# Altium project 磁导航.PrjPCB
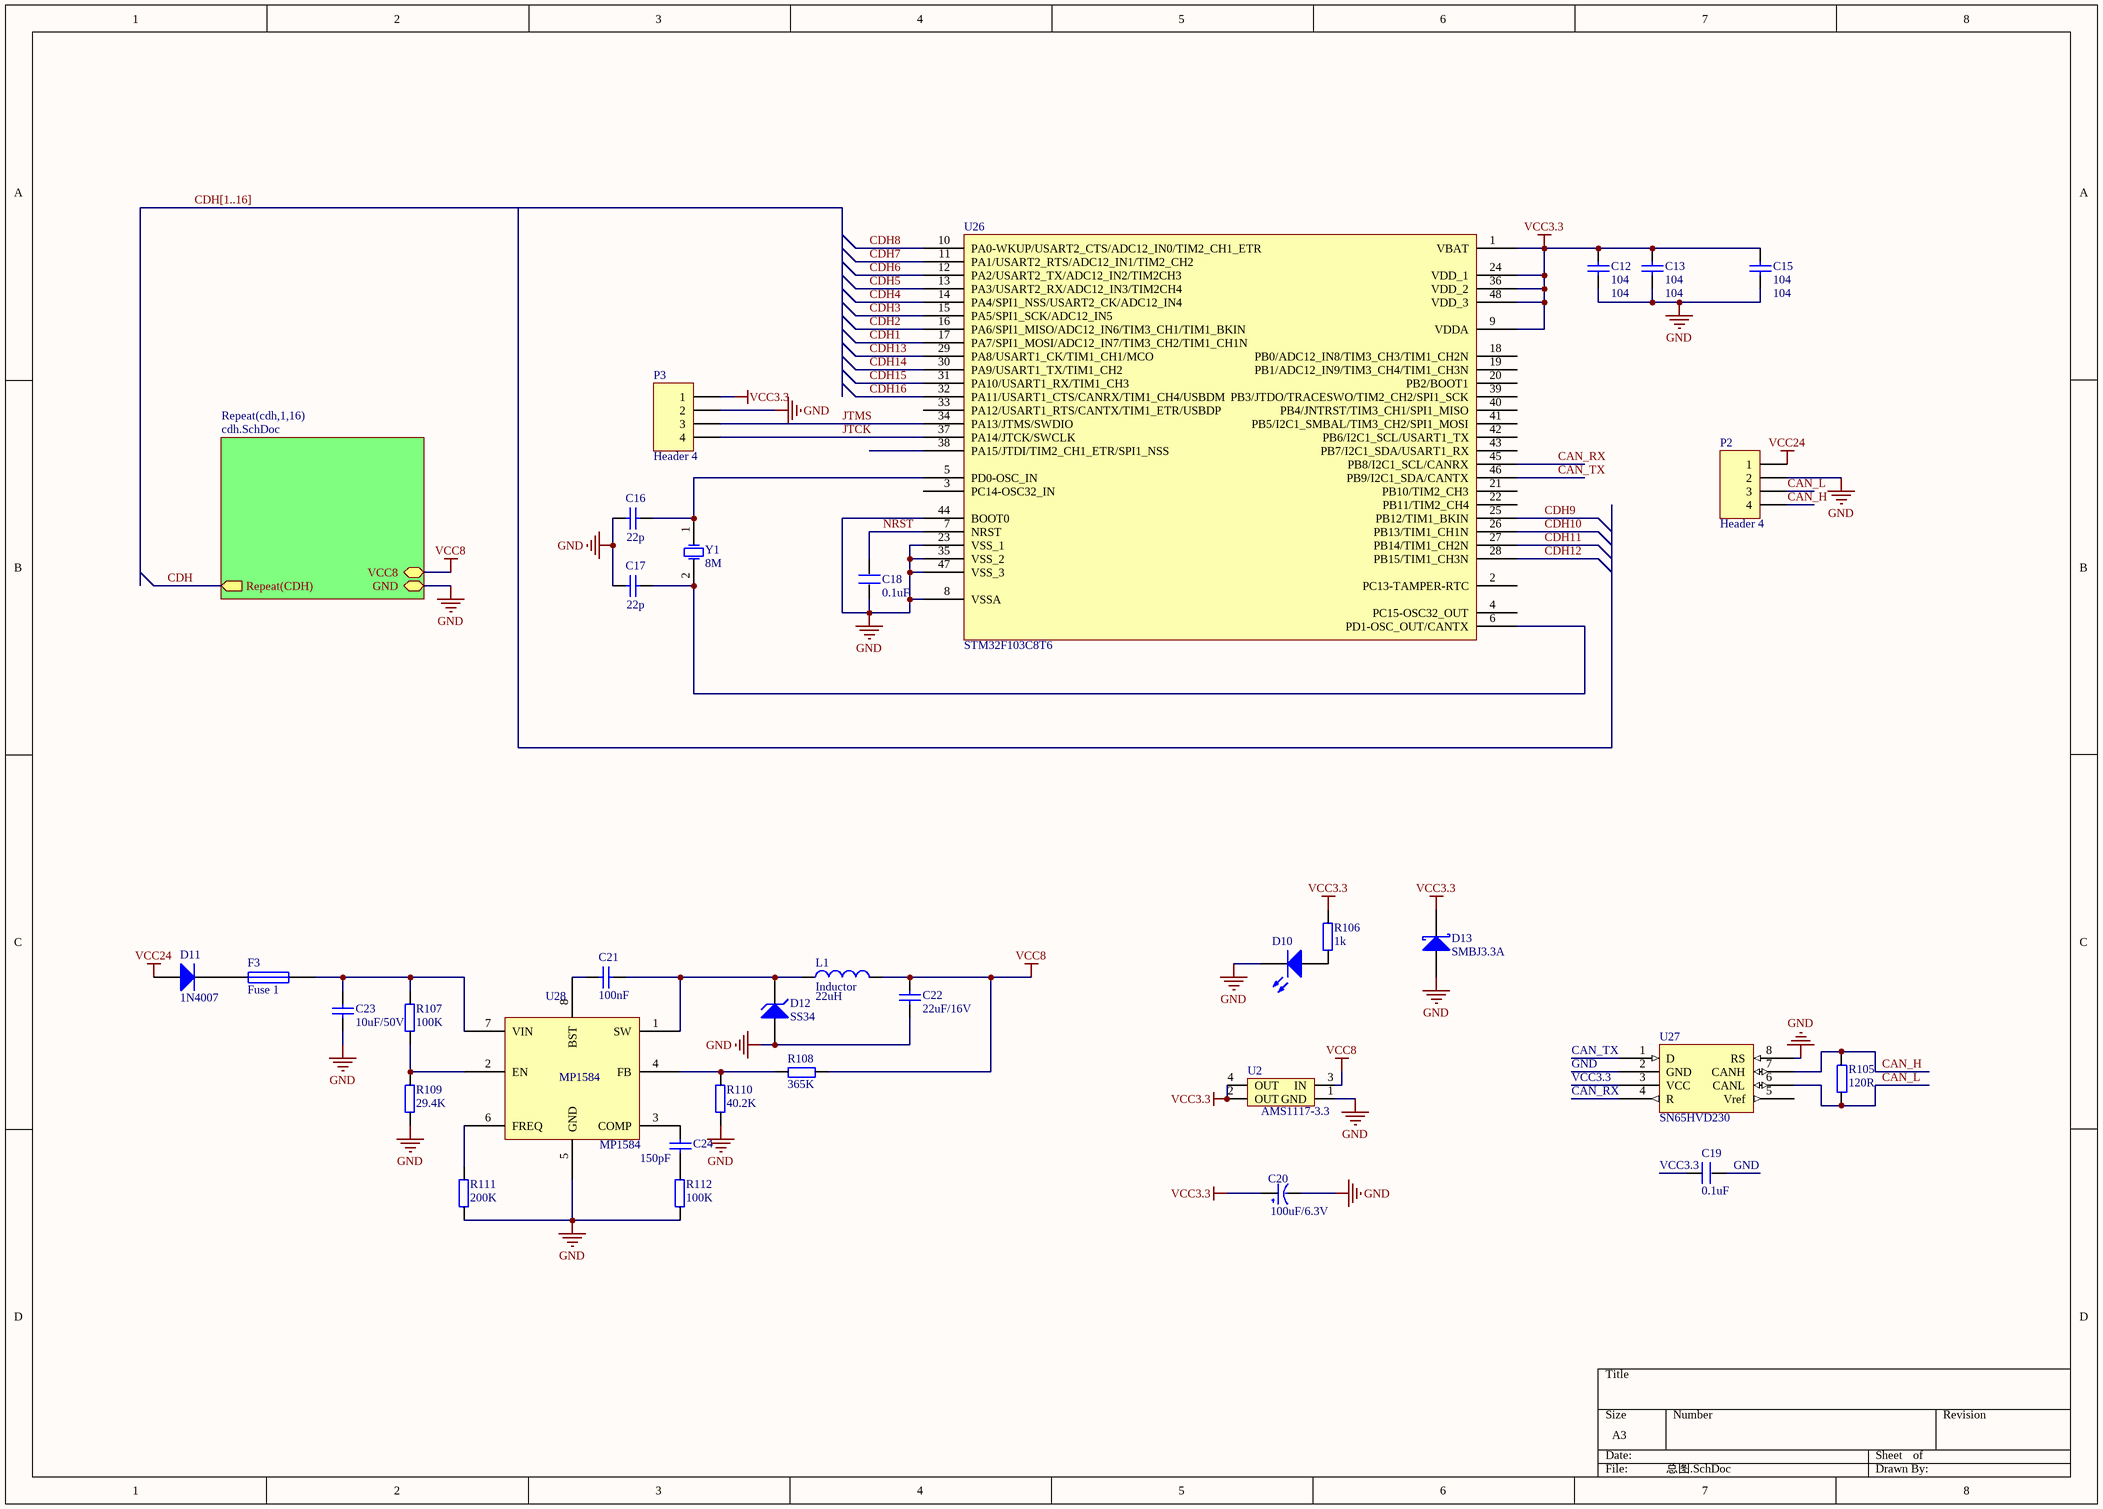
[diagram p0: 总图.SchDoc]
2 sheets, 337 parts. Net scope: hierarchical (ports join the sheet entries above them; power ports are global).
Board files: 磁导航.PcbDoc, 多通道.PcbDoc, 多通道.~(1096).PcbDoc, 尺寸.PcbDoc
Sheets:
  总图.SchDoc
    cdh1 = cdh.SchDoc
    cdh2 = cdh.SchDoc
    cdh3 = cdh.SchDoc
    cdh4 = cdh.SchDoc
    cdh5 = cdh.SchDoc
    cdh6 = cdh.SchDoc
    cdh7 = cdh.SchDoc
    cdh8 = cdh.SchDoc
    cdh9 = cdh.SchDoc
    cdh10 = cdh.SchDoc
    cdh11 = cdh.SchDoc
    cdh12 = cdh.SchDoc
    cdh13 = cdh.SchDoc
    cdh14 = cdh.SchDoc
    cdh15 = cdh.SchDoc
    cdh16 = cdh.SchDoc

## Sheet 总图.SchDoc
size A3

### Parts
C12  104  [0603-CAP]
C13  104  [0603-CAP]
C15  104  [0603-CAP]
C16  22p  [0603-CAP]
C17  22p  [0603-CAP]
C18  0.1uF  [0603-CAP]
C19  0.1uF  [0603-CAP]
C20  100uF/6.3V  [3216]
C21  value 100nF  [0603-CAP]  (hidden comment: 0.1uF)
C22  22uF/16V  [1206]
C23  10uF/50V  [1206]
C24  value 150pF  [0603-CAP]  (hidden comment: 0.1uF)
D10  LED0  [LC-0805_LED_S1]  (value not drawn)
D11  1N4007  [SMA(DO-214AC)_S1]
D12  SS34  [SMA(DO-214AC)_S1]
D13  SMBJ3.3A  [SMB(DO-214AA)_S1]
F3  Fuse 1  [1206]
L1  Inductor  value 22uH  [L-7*7*4mm-S]
P2  Header 4  [DZ-4-3.5]
P3  Header 4  [HDR1X4]
R105  120R  [0603]
R106  1k  [0603]
R107  100K  [0603]
R108  365K  [0603]
R109  29.4K  [0603]
R110  40.2K  [0603]
R111  200K  [0603]
R112  100K  [0603]
U2  AMS1117-3.3  [LC-SOT-223]
U26  STM32F103C8T6  [LC-LQFP-48]
U27  SN65HVD230  [SOP-8]
U28  MP1584  [SO-8]
Y1  8M  [XTAL_US1]

### Sub-sheets
Repeat(cdh,1,16) = cdh.SchDoc: GND (bidir), VCC8 (bidir), Repeat(CDH) (out)

### Nets
GND: C12.2 C13.2 C15.2 C16.2 C17.2 C18.1 C19.2 C20.2(GND) C22.1 C23.2 D10.K D12.1(A) D13.2(A) P2.2 P3.2 R109.2 R110.2 R111.2 R112.2 U2.1(GND) U26.8(VSSA) U26.23(VSS_1) U26.35(VSS_2) U26.44(BOOT0) U26.47(VSS_3) U27.2(GND) U27.8(RS) U28.5(GND) ; sheet Repeat(cdh,1,16)/GND
VCC3.3: C12.1 C13.1 C15.1 C19.1 C20.1(VCC) D13.1(K) P3.1 R106.1 U2.2(OUT) U2.4(OUT) U26.1(VBAT) U26.9(VDDA) U26.24(VDD_1) U26.36(VDD_2) U26.48(VDD_3) U27.3(VCC)
VCC8: C22.2 L1.2 R108.2 U2.3(IN) ; sheet Repeat(cdh,1,16)/VCC8
VCC24: D11.1(A) P2.1
CAN_H: P2.4 R105.2 U27.7(CANH)
CAN_L: P2.3 R105.1 U27.6(CANL)
CAN_RX: U26.45(PB8/I2C1_SCL/CANRX) U27.4(R)
CAN_TX: U26.46(PB9/I2C1_SDA/CANTX) U27.1(D)
CDH: sheet Repeat(cdh,1,16)/Repeat(CDH)
CDH1: U26.17(PA7/SPI1_MOSI/ADC12_IN7/TIM3_CH2/TIM1_CH1N)
CDH2: U26.16(PA6/SPI1_MISO/ADC12_IN6/TIM3_CH1/TIM1_BKIN)
CDH3: U26.15(PA5/SPI1_SCK/ADC12_IN5)
CDH4: U26.14(PA4/SPI1_NSS/USART2_CK/ADC12_IN4)
CDH5: U26.13(PA3/USART2_RX/ADC12_IN3/TIM2CH4)
CDH6: U26.12(PA2/USART2_TX/ADC12_IN2/TIM2CH3)
CDH7: U26.11(PA1/USART2_RTS/ADC12_IN1/TIM2_CH2)
CDH8: U26.10(PA0-WKUP/USART2_CTS/ADC12_IN0/TIM2_CH1_ETR)
CDH9: U26.25(PB12/TIM1_BKIN)
CDH10: U26.26(PB13/TIM1_CH1N)
CDH11: U26.27(PB14/TIM1_CH2N)
CDH12: U26.28(PB15/TIM1_CH3N)
CDH13: U26.29(PA8/USART1_CK/TIM1_CH1/MCO)
CDH14: U26.30(PA9/USART1_TX/TIM1_CH2)
CDH15: U26.31(PA10/USART1_RX/TIM1_CH3)
CDH16: U26.32(PA11/USART1_CTS/CANRX/TIM1_CH4/USBDM)
JTCK: P3.4 U26.37(PA14/JTCK/SWCLK)
JTMS: P3.3 U26.34(PA13/JTMS/SWDIO)
NRST: C18.2 U26.7(NRST)
NetC16_1: C16.1 U26.5(PD0-OSC_IN) Y1.1(OSC1)
NetC17_1: C17.1 U26.6(PD1-OSC_OUT/CANTX) Y1.2(OSC2)
NetC21_1: C21.1 D12.2(K) L1.1 U28.1(SW)
NetC21_2: C21.2 U28.8(BST)
NetC23_1: C23.1 F3.2 R107.1 U28.7(VIN)
NetC24_1: C24.1 R112.1
NetC24_2: C24.2 U28.3(COMP)
NetD10_A: D10.A R106.2
NetD11_2: D11.2(K) F3.1
NetR107_2: R107.2 R109.1 U28.2(EN)
NetR108_1: R108.1 R110.1 U28.4(FB)
NetR111_1: R111.1 U28.6(FREQ)

Not connected (* = marked no-connect by the designer): U26 2(PC13-TAMPER-RTC) 3(PC14-OSC32_IN) 4(PC15-OSC32_OUT) 18(PB0/ADC12_IN8/TIM3_CH3/TIM1_CH2N) 19(PB1/ADC12_IN9/TIM3_CH4/TIM1_CH3N) 20(PB2/BOOT1) 21(PB10/TIM2_CH3) 22(PB11/TIM2_CH4) 33(PA12/USART1_RTS/CANTX/TIM1_ETR/USBDP) 38(PA15/JTDI/TIM2_CH1_ETR/SPI1_NSS) 39(PB3/JTDO/TRACESWO/TIM2_CH2/SPI1_SCK) 40(PB4/JNTRST/TIM3_CH1/SPI1_MISO) 41(PB5/I2C1_SMBAL/TIM3_CH2/SPI1_MOSI) 42(PB6/I2C1_SCL/USART1_TX) 43(PB7/I2C1_SDA/USART1_RX); U27 5(Vref)

### Buses and harness runs
bus CDH[1..16]

### Library data of the parts
C12 C13 C15-C17 = Cap: Capacitor; Published: 8-Jun-2000; LatestRevisionDate: 17-Jul-2002; LatestRevisionNote: Re-released for DXP Platform.; PackageReference: RAD-0.3; Publisher: Altium Limited; PackageDescription: Radial Cap, Thru-Hole; 2 Leads; 0.3 in Pin Spacing
  C12 C13 C15: Value: 104
  C16 C17: Value: 22p
C18 = C
C19 = C_3
C20 = CAP
C21-C24 = Cap Semi: Capacitor (Semiconductor SIM Model); Published: 8-Jun-2000; LatestRevisionDate: 29-May-2009; LatestRevisionNote: IPC-7351 Footprint Added.; PackageReference: C1206; Publisher: Altium Limited; PackageDescription: Chip Capacitor
  C22: Value: 22uF/16V
  C23: Value: 10uF/50V
D10 = LED0: Typical INFRARED GaAs LED; Published: 8-Jun-2000; LatestRevisionDate: 08-Jul-2005; LatestRevisionNote: Mech Layer 1 removed.; PackageReference: LED-0; Publisher: Altium Limited; PackageDescription: LED; 2 Leads
D11 = Diode: Default Diode; Published: 8-Jun-2000; LatestRevisionDate: 17-Jul-2002; LatestRevisionNote: Re-released for DXP Platform.; PackageVersion: Sep-1996; PackageReference: SMC; Publisher: Altium Limited; PackageDescription: DO-214-AB/SMC; 2 C-Bend Leads; Body 7.9 x 5.9 mm, inc. leads (LxW); Code_JEDEC: DO-214-AB
D12 = D Zener: Zener Diode; Published: 8-Jun-2000; LatestRevisionDate: 17-Jul-2002; LatestRevisionNote: Re-released for DXP Platform.; PackageReference: DIODE-0.7; Publisher: Altium Limited; PackageDescription: Diode, Thru-Hole; 2 Leads; 0.7 in Pin Spacing
D13 = Diode 18TQ045: Schottky Rectifier; Note: Terminal 2 is the TAB and is electrically connected to the cathode; Published: 8-Jun-2000; LatestRevisionDate: 17-Jul-2002; LatestRevisionNote: Re-released for DXP Platform.; DatasheetVersion: Dec-1997; PackageVersion: Feb-1998; PackageReference: TO-220AC; Publisher: Altium Limited; PackageDescription: TO, Thru-Hole, Vertical, Heatsink Mounted; 3 In-Line Leads (1 Absent); Pitch 2.54 mm; ComponentLink1Description: Manufacturer Link; ComponentLink1URL: http://www.irf.com/; ComponentLink2Description: Datasheet; ComponentLink2URL: http://www.irf.com/product-info/datasheets/data/18tq.pdf
F3 = Fuse 1: Fuse; Published: 8-Jun-2000; LatestRevisionDate: 17-Jul-2002; LatestRevisionNote: Re-released for DXP Platform.; PackageReference: PIN-W2/E2.8; Publisher: Altium Limited; PackageDescription: Thru-Hole; 2 Leads
L1 = Inductor: Code_IEC: 1005; Published: 8-Jun-2000; LatestRevisionDate: 29-May-2009; LatestRevisionNote: IPC-7351 Footprint Added.; PackageReference: 0402-A; Publisher: Altium Limited; PackageDescription: Chip Inductor; Code_JEITA: 0402
P2 P3 = Header 4: Header, 4-Pin; LatestRevisionDate: 17-Jul-2002; LatestRevisionNote: Re-released for DXP Platform.; Publisher: Altium Limited
R105-R112 = R_2
U2 = AMS1117
U26 = stm32f103v8t6
U27 = SN65HVD230D
U28 = MP1584EN
Y1 = XTAL: Crystal Oscillator; Published: 8-Jun-2000; LatestRevisionDate: 17-Jul-2002; LatestRevisionNote: Re-released for DXP Platform.; PackageReference: R38; Publisher: Altium Limited; PackageDescription: Crystal, Thru-Hole; 2 Leads; Body 3.1 x 8.2 mm (Dia.xH)

## Sheet cdh.SchDoc
size A3
Used 16 times, as channels cdh1, cdh2, cdh3, cdh4, cdh5, cdh6, cdh7, cdh8, cdh9, cdh10, cdh11, cdh12, cdh13, cdh14, cdh15, cdh16. Parts and nets are listed once, with the designators drawn on the sheet.
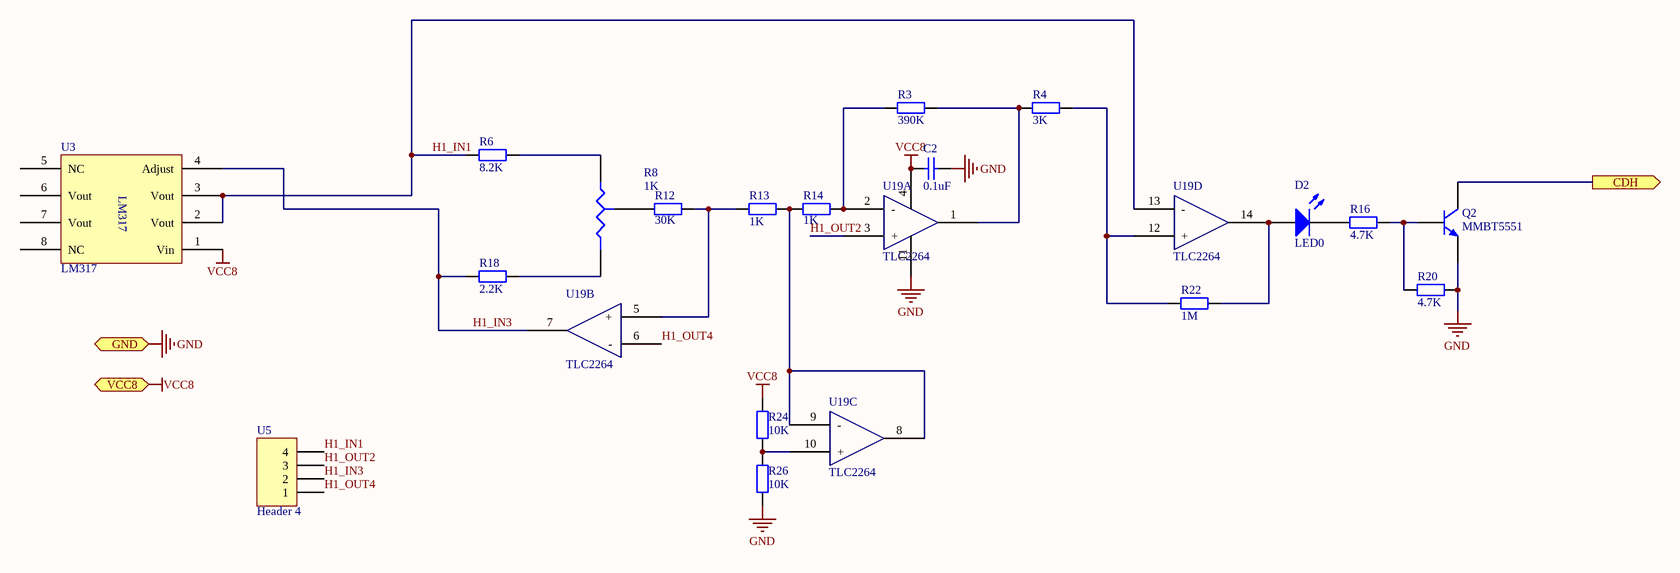
[diagram p1: cdh.SchDoc]

### Parts
C2  0.1uF  [C0805]
D2  LED0  [LED1]
Q2  MMBT5551  [SOT-23]
R3  390K  [0805]
R4  3K  [0805]
R6  8.2K  [0805]
R8  value 1K  [3224W]  (hidden comment: Res Tap)
R12  30K  [0805]
R13  1K  [0805]
R14  1K  [0805]
R16  4.7K  [0603]
R18  2.2K  [0805]
R20  4.7K  [0603]
R22  1M  [0805]
R24  10K  [0805]
R26  10K  [0805]
U3  LM317  [SO-8]
U5  Header 4  [PIN4]
U19  TLC2264  [TSSOP14]  (parts A,B,C,D of 4)

### Ports
CDH (out), GND (bidir), VCC8 (bidir)

### Nets
GND: C2.1 Q2.3(E) R20.2 R26.1 U19.11(GND) ; port GND
VCC8: C2.2 R24.2 U3.1(Vin) U19.4(VCC) ; port VCC8
CDH: Q2.1(C) ; port CDH
H1_IN1: R6.1 U3.2(Vout) U3.3(Vout) U5.4 U19.13(-)
H1_IN3: R18.1 U3.4(Adjust) U5.2 U19.7(2OUT)
H1_OUT2: U5.3 U19.3(+)
H1_OUT4: U5.1 U19.6(-)
NetD2_1: D2.1(A) R22.2 U19.14(4OUT)
NetD2_2: D2.2(K) R16.1
NetQ2_2: Q2.2(B) R16.2 R20.1
NetR3_1: R3.1 R14.1 U19.2(-)
NetR3_2: R3.2 R4.1 U19.1(1OUT)
NetR4_2: R4.2 R22.1 U19.12(+)
NetR6_2: R6.2 R8.1(A)
NetR8_2: R8.2(B) R18.2
NetR8_3: R8.3(TAP) R12.1
NetR12_2: R12.2 R13.1 U19.5(+)
NetR13_2: R13.2 R14.2 U19.8(3OUT) U19.9(-)
NetR24_1: R24.1 R26.2 U19.10(+)

Not connected (* = marked no-connect by the designer): U3 5(NC) 6(Vout) 7(Vout) 8(NC)

### Channels
cdh1: designators end in _cdh1; ports CDH=CDH1 GND=GND VCC8=VCC8
cdh2: designators end in _cdh2; ports CDH=CDH2 GND=GND VCC8=VCC8
cdh3: designators end in _cdh3; ports CDH=CDH3 GND=GND VCC8=VCC8
cdh4: designators end in _cdh4; ports CDH=CDH4 GND=GND VCC8=VCC8
cdh5: designators end in _cdh5; ports CDH=CDH5 GND=GND VCC8=VCC8
cdh6: designators end in _cdh6; ports CDH=CDH6 GND=GND VCC8=VCC8
cdh7: designators end in _cdh7; ports CDH=CDH7 GND=GND VCC8=VCC8
cdh8: designators end in _cdh8; ports CDH=CDH8 GND=GND VCC8=VCC8
cdh9: designators end in _cdh9; ports CDH=CDH9 GND=GND VCC8=VCC8
cdh10: designators end in _cdh10; ports CDH=CDH10 GND=GND VCC8=VCC8
cdh11: designators end in _cdh11; ports CDH=CDH11 GND=GND VCC8=VCC8
cdh12: designators end in _cdh12; ports CDH=CDH12 GND=GND VCC8=VCC8
cdh13: designators end in _cdh13; ports CDH=CDH13 GND=GND VCC8=VCC8
cdh14: designators end in _cdh14; ports CDH=CDH14 GND=GND VCC8=VCC8
cdh15: designators end in _cdh15; ports CDH=CDH15 GND=GND VCC8=VCC8
cdh16: designators end in _cdh16; ports CDH=CDH16 GND=GND VCC8=VCC8

### Library data of the parts
C2 = Cap Semi: Capacitor (Semiconductor SIM Model); Published: 8-Jun-2000; LatestRevisionDate: 29-May-2009; LatestRevisionNote: IPC-7351 Footprint Added.; PackageReference: C1206; Publisher: Altium Limited; PackageDescription: Chip Capacitor; Value: 0.1uF
D2 = LED0: Typical INFRARED GaAs LED; Published: 8-Jun-2000; LatestRevisionDate: 08-Jul-2005; LatestRevisionNote: Mech Layer 1 removed.; PackageReference: LED-0; Publisher: Altium Limited; PackageDescription: LED; 2 Leads
Q2 = NPN: NPN Bipolar Transistor; Published: 8-Jun-2000; LatestRevisionDate: 17-Jul-2002; LatestRevisionNote: Re-released for DXP Platform.; PackageReference: TO-226-AA; Publisher: Altium Limited; PackageDescription: TO, Flat Index; 3 In-Line, Axial Leads; Body Dia. 4.8mm; Leads 0.55 x 0.51 mm (max); Code_JEDEC: TO-226-AA
R3 R4 R6 R12-R14 R16 R18 R20 R22 R24 R26 = Res2: Resistor; Published: 8-Jun-2000; LatestRevisionDate: 17-Jul-2002; LatestRevisionNote: Re-released for DXP Platform.; PackageReference: AXIAL-0.4; Publisher: Altium Limited; PackageDescription: Axial Device, Thru-Hole; 2 Leads; 0.4 in Pin Spacing
  R3: Value: 390K
  R4: Value: 3K
  R6: Value: 8.2K
  R12: Value: 30K
  R13 R14: Value: 1K
  R16 R20: Value: 4.7K
  R18: Value: 2.2K
  R22: Value: 1M
  R24 R26: Value: 10K
R8 = Res Tap: Tapped Resistor; Sim Note: Enter the Resistance value and the set point into parameter fields.; Set Position: 0.5; Published: 24-Mar-1999; LatestRevisionDate: 17-Jul-2002; LatestRevisionNote: Re-released for DXP Platform.; PackageReference: VR3; Publisher: Altium Limited; PackageDescription: Variable Resistor, Thru-Hole; 3 Leads
U5 = Header 4: Header, 4-Pin; LatestRevisionDate: 17-Jul-2002; LatestRevisionNote: Re-released for DXP Platform.; Publisher: Altium Limited

## Nets that join several sheets
GND: 总图 (28 pins), cdh1 (5 pins), cdh2 (5 pins), cdh3 (5 pins), cdh4 (5 pins), cdh5 (5 pins), cdh6 (5 pins), cdh7 (5 pins), cdh8 (5 pins), cdh9 (5 pins), cdh10 (5 pins), cdh11 (5 pins), cdh12 (5 pins), cdh13 (5 pins), cdh14 (5 pins), cdh15 (5 pins), cdh16 (5 pins)
VCC8: 总图 (C22.2 L1.2 R108.2 U2.3), cdh1 (C2_cdh1.2 R24_cdh1.2 U3_cdh1.1 U19_cdh1.4), cdh2 (C2_cdh2.2 R24_cdh2.2 U3_cdh2.1 U19_cdh2.4), cdh3 (C2_cdh3.2 R24_cdh3.2 U3_cdh3.1 U19_cdh3.4), cdh4 (C2_cdh4.2 R24_cdh4.2 U3_cdh4.1 U19_cdh4.4), cdh5 (C2_cdh5.2 R24_cdh5.2 U3_cdh5.1 U19_cdh5.4), cdh6 (C2_cdh6.2 R24_cdh6.2 U3_cdh6.1 U19_cdh6.4), cdh7 (C2_cdh7.2 R24_cdh7.2 U3_cdh7.1 U19_cdh7.4), cdh8 (C2_cdh8.2 R24_cdh8.2 U3_cdh8.1 U19_cdh8.4), cdh9 (C2_cdh9.2 R24_cdh9.2 U3_cdh9.1 U19_cdh9.4), cdh10 (C2_cdh10.2 R24_cdh10.2 U3_cdh10.1 U19_cdh10.4), cdh11 (C2_cdh11.2 R24_cdh11.2 U3_cdh11.1 U19_cdh11.4), cdh12 (C2_cdh12.2 R24_cdh12.2 U3_cdh12.1 U19_cdh12.4), cdh13 (C2_cdh13.2 R24_cdh13.2 U3_cdh13.1 U19_cdh13.4), cdh14 (C2_cdh14.2 R24_cdh14.2 U3_cdh14.1 U19_cdh14.4), cdh15 (C2_cdh15.2 R24_cdh15.2 U3_cdh15.1 U19_cdh15.4), cdh16 (C2_cdh16.2 R24_cdh16.2 U3_cdh16.1 U19_cdh16.4)
CDH1: 总图 (U26.17), cdh1 (Q2_cdh1.1)
CDH2: 总图 (U26.16), cdh2 (Q2_cdh2.1)
CDH3: 总图 (U26.15), cdh3 (Q2_cdh3.1)
CDH4: 总图 (U26.14), cdh4 (Q2_cdh4.1)
CDH5: 总图 (U26.13), cdh5 (Q2_cdh5.1)
CDH6: 总图 (U26.12), cdh6 (Q2_cdh6.1)
CDH7: 总图 (U26.11), cdh7 (Q2_cdh7.1)
CDH8: 总图 (U26.10), cdh8 (Q2_cdh8.1)
CDH9: 总图 (U26.25), cdh9 (Q2_cdh9.1)
CDH10: 总图 (U26.26), cdh10 (Q2_cdh10.1)
CDH11: 总图 (U26.27), cdh11 (Q2_cdh11.1)
CDH12: 总图 (U26.28), cdh12 (Q2_cdh12.1)
CDH13: 总图 (U26.29), cdh13 (Q2_cdh13.1)
CDH14: 总图 (U26.30), cdh14 (Q2_cdh14.1)
CDH15: 总图 (U26.31), cdh15 (Q2_cdh15.1)
CDH16: 总图 (U26.32), cdh16 (Q2_cdh16.1)